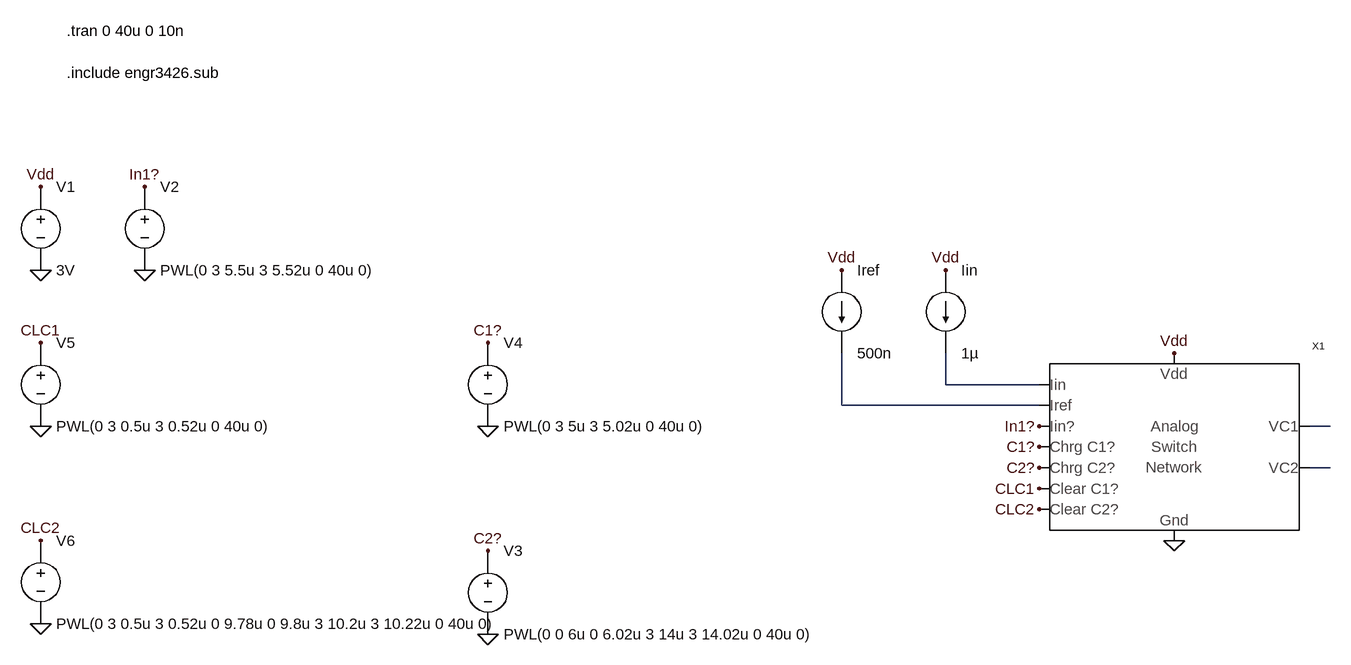
[diagram p0: schematic analog_switch_current_steer_test.asc]
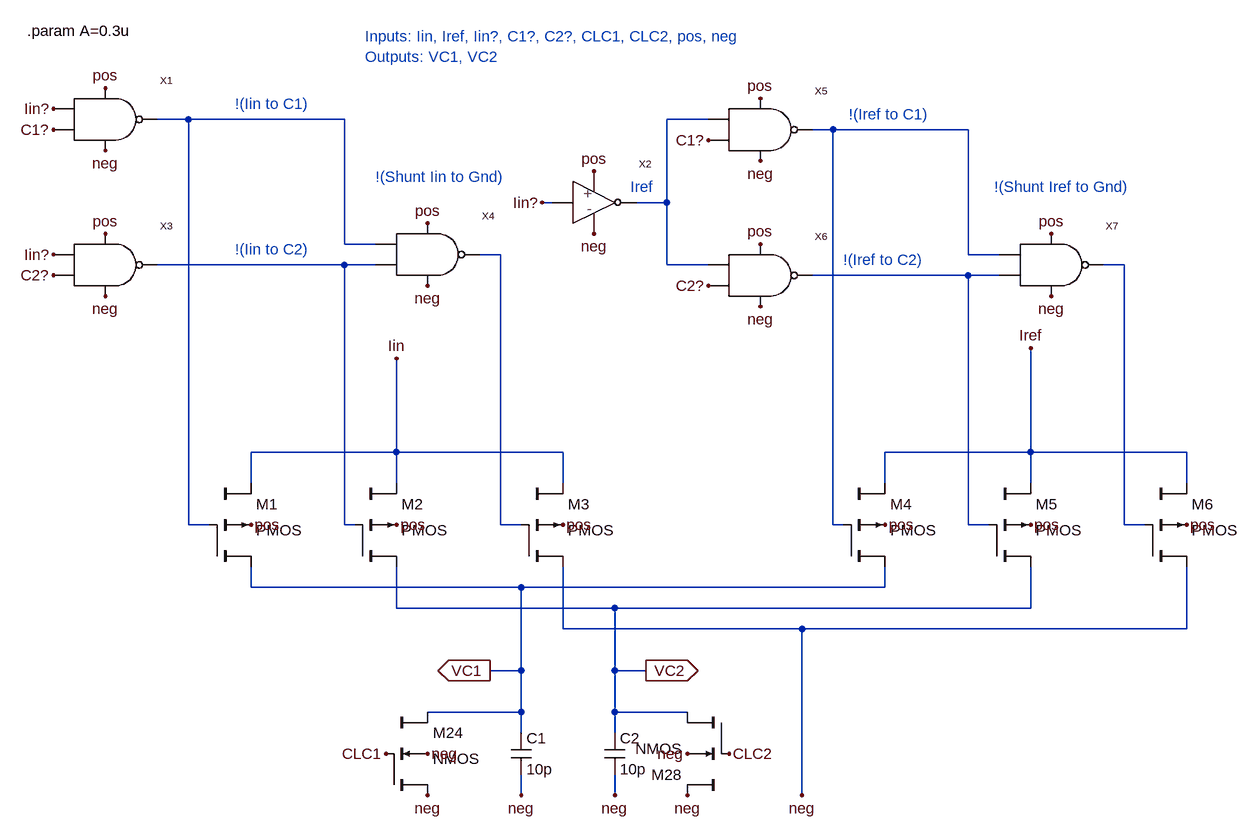
[diagram p1: sub-circuit analog_switch_current_steer.asc]
analog_switch_current_steer_test.asc, the LTspice schematic file:
Version 4
SHEET 1 2404 980
WIRE 960 16 960 -32
WIRE 1104 16 960 16
WIRE 800 48 800 -32
WIRE 1104 48 800 48
WIRE 1552 80 1520 80
WIRE 1552 144 1520 144
FLAG 960 -160 Vdd
FLAG 800 -160 Vdd
FLAG -432 -160 0
FLAG -432 -288 Vdd
FLAG -272 -160 0
FLAG -272 -288 In1?
FLAG 256 400 0
FLAG 256 272 C2?
FLAG 256 80 0
FLAG 256 -48 C1?
FLAG -432 80 0
FLAG -432 -48 CLC1
FLAG -432 384 0
FLAG -432 256 CLC2
FLAG 1104 80 In1?
FLAG 1104 112 C1?
FLAG 1104 144 C2?
FLAG 1104 176 CLC1
FLAG 1104 208 CLC2
FLAG 1312 -32 Vdd
FLAG 1312 256 0
SYMBOL cktsym\\isource 960 -96 R0
WINDOW 123 0 0 Left 2
WINDOW 39 0 0 Left 2
SYMATTR Value 1µ
SYMATTR InstName Iin
SYMBOL cktsym\\isource 800 -96 R0
WINDOW 123 0 0 Left 2
WINDOW 39 0 0 Left 2
SYMATTR Value 500n
SYMATTR InstName Iref
SYMBOL cktsym\\vsource -432 -224 R0
WINDOW 123 0 0 Left 2
WINDOW 39 0 0 Left 2
SYMATTR Value 3V
SYMATTR InstName V1
SYMBOL cktsym\\vsource -272 -224 R0
WINDOW 123 0 0 Left 2
WINDOW 39 0 0 Left 2
SYMATTR Value PWL(0 3 5.5u 3 5.52u 0 40u 0)
SYMATTR InstName V2
SYMBOL cktsym\\vsource 256 336 R0
WINDOW 123 0 0 Left 2
WINDOW 39 0 0 Left 2
SYMATTR Value PWL(0 0 6u 0 6.02u 3 14u 3 14.02u 0 40u 0)
SYMATTR InstName V3
SYMBOL cktsym\\vsource 256 16 R0
WINDOW 123 0 0 Left 2
WINDOW 39 0 0 Left 2
SYMATTR Value PWL(0 3 5u 3 5.02u 0 40u 0)
SYMATTR InstName V4
SYMBOL cktsym\\vsource -432 16 R0
WINDOW 123 0 0 Left 2
WINDOW 39 0 0 Left 2
SYMATTR Value PWL(0 3 0.5u 3 0.52u 0 40u 0)
SYMATTR InstName V5
SYMBOL cktsym\\vsource -432 320 R0
WINDOW 123 0 0 Left 2
WINDOW 39 0 0 Left 2
SYMATTR Value PWL(0 3 0.5u 3 0.52u 0 9.78u 0 9.8u 3 10.2u 3 10.22u 0 40u 0)
SYMATTR InstName V6
SYMBOL analog_switch_current_steer 1312 112 R0
SYMATTR InstName X1
TEXT -392 -464 Left 2 !.include engr3426.sub
TEXT -392 -528 Left 2 !.tran 0 40u 0 10n

analog_switch_current_steer.asc, the sub-circuit schematic file:
Version 4
SHEET 1 2628 980
WIRE 272 -576 224 -576
WIRE 512 -576 272 -576
WIRE 1072 -576 1008 -576
WIRE 1264 -560 1232 -560
WIRE 1472 -560 1264 -560
WIRE 832 -448 816 -448
WIRE 1008 -448 1008 -576
WIRE 1008 -448 960 -448
WIRE 512 -384 512 -576
WIRE 560 -384 512 -384
WIRE 752 -368 720 -368
WIRE 1472 -368 1472 -560
WIRE 1520 -368 1472 -368
WIRE 512 -352 224 -352
WIRE 560 -352 512 -352
WIRE 1008 -352 1008 -448
WIRE 1072 -352 1008 -352
WIRE 1712 -352 1680 -352
WIRE 1472 -336 1232 -336
WIRE 1520 -336 1472 -336
WIRE 592 -64 592 -208
WIRE 592 -64 368 -64
WIRE 848 -64 592 -64
WIRE 1568 -64 1568 -224
WIRE 1568 -64 1344 -64
WIRE 1808 -64 1568 -64
WIRE 368 -16 368 -64
WIRE 592 -16 592 -64
WIRE 848 -16 848 -64
WIRE 1344 -16 1344 -64
WIRE 1568 -16 1568 -64
WIRE 1808 -16 1808 -64
WIRE 272 48 272 -576
WIRE 304 48 272 48
WIRE 512 48 512 -352
WIRE 528 48 512 48
WIRE 752 48 752 -368
WIRE 784 48 752 48
WIRE 1264 48 1264 -560
WIRE 1280 48 1264 48
WIRE 1472 48 1472 -336
WIRE 1504 48 1472 48
WIRE 1712 48 1712 -352
WIRE 1744 48 1712 48
WIRE 368 144 368 112
WIRE 784 144 368 144
WIRE 1344 144 1344 112
WIRE 1344 144 784 144
WIRE 592 176 592 112
WIRE 928 176 592 176
WIRE 1568 176 1568 112
WIRE 1568 176 928 176
WIRE 848 208 848 112
WIRE 1216 208 848 208
WIRE 1808 208 1808 112
WIRE 1808 208 1216 208
WIRE 784 272 784 144
WIRE 784 272 736 272
WIRE 928 272 928 176
WIRE 976 272 928 272
WIRE 784 336 784 272
WIRE 784 336 640 336
WIRE 928 336 928 272
WIRE 1040 336 928 336
WIRE 784 368 784 336
WIRE 928 368 928 336
WIRE 784 464 784 432
WIRE 928 464 928 432
WIRE 1216 464 1216 208
FLAG 368 48 pos
FLAG 592 48 pos
FLAG 1344 48 pos
FLAG 1568 48 pos
FLAG 1808 48 pos
FLAG 816 -448 Iin?
FLAG 576 400 CLC1
FLAG 1104 400 CLC2
FLAG 848 48 pos
FLAG 640 464 neg
FLAG 784 464 neg
FLAG 928 464 neg
FLAG 1040 464 neg
FLAG 640 400 neg
FLAG 1040 400 neg
FLAG 1216 464 neg
FLAG 64 -560 C1?
FLAG 64 -592 Iin?
FLAG 144 -624 pos
FLAG 144 -528 neg
FLAG 896 -400 neg
FLAG 896 -496 pos
FLAG 64 -336 C2?
FLAG 64 -368 Iin?
FLAG 144 -400 pos
FLAG 144 -304 neg
FLAG 640 -416 pos
FLAG 640 -320 neg
FLAG 1072 -544 C1?
FLAG 1152 -608 pos
FLAG 1152 -512 neg
FLAG 1072 -320 C2?
FLAG 1152 -384 pos
FLAG 1152 -288 neg
FLAG 1600 -400 pos
FLAG 1600 -304 neg
FLAG 592 -208 Iin
FLAG 1568 -224 Iref
FLAG 736 272 VC1
IOPIN 736 272 Out
FLAG 976 272 VC2
IOPIN 976 272 Out
SYMBOL cktsym\\pmos4 368 48 R0
SYMATTR InstName M1
SYMATTR Value2 l={2*A} w={6*A}
SYMBOL cktsym\\pmos4 592 48 R0
SYMATTR InstName M2
SYMATTR Value2 l={2*A} w={6*A}
SYMBOL cktsym\\pmos4 1344 48 R0
SYMATTR InstName M4
SYMATTR Value2 l={2*A} w={6*A}
SYMBOL cktsym\\pmos4 1568 48 R0
SYMATTR InstName M5
SYMATTR Value2 l={2*A} w={6*A}
SYMBOL cktsym\\pmos4 1808 48 R0
SYMATTR InstName M6
SYMATTR Value2 l={2*A} w={6*A}
SYMBOL cap 768 368 R0
SYMATTR InstName C1
SYMATTR Value 10p
SYMBOL cap 912 368 R0
SYMATTR InstName C2
SYMATTR Value 10p
SYMBOL cktsym\\nmos4 640 400 R0
SYMATTR InstName M24
SYMATTR Value2 l={2*A} w={24*A}
SYMBOL cktsym\\nmos4 1040 400 R180
SYMATTR InstName M28
SYMATTR Value2 l={2*A} w={24*A}
SYMBOL cktsym\\pmos4 848 48 R0
SYMATTR InstName M3
SYMATTR Value2 l={2*A} w={6*A}
SYMBOL NAND 144 -576 R0
SYMATTR InstName X1
SYMATTR SpiceLine nmosL={2*A} pmosL={2*A} nmosW={3*A} pmosW={6*A}
SYMBOL Inverter 896 -448 R0
SYMATTR InstName X2
SYMATTR SpiceLine nmosL={2*A} pmosL={2*A} nmosW={3*A} pmosW={6*A}
SYMBOL NAND 144 -352 R0
SYMATTR InstName X3
SYMATTR SpiceLine nmosL={2*A} pmosL={2*A} nmosW={3*A} pmosW={6*A}
SYMBOL NAND 640 -368 R0
SYMATTR InstName X4
SYMATTR SpiceLine nmosL={2*A} pmosL={2*A} nmosW={3*A} pmosW={6*A}
SYMBOL NAND 1152 -560 R0
SYMATTR InstName X5
SYMATTR SpiceLine nmosL={2*A} pmosL={2*A} nmosW={3*A} pmosW={6*A}
SYMBOL NAND 1152 -336 R0
SYMATTR InstName X6
SYMATTR SpiceLine nmosL={2*A} pmosL={2*A} nmosW={3*A} pmosW={6*A}
SYMBOL NAND 1600 -352 R0
SYMATTR InstName X7
SYMATTR SpiceLine nmosL={2*A} pmosL={2*A} nmosW={3*A} pmosW={6*A}
TEXT 344 -376 Left 2 ;!(Iin to C2)
TEXT 344 -600 Left 2 ;!(Iin to C1)
TEXT 24 -712 Left 2 !.param A=0.3u
TEXT 560 -488 Left 2 ;!(Shunt Iin to Gnd)
TEXT 952 -472 Left 2 ;Iref
TEXT 1288 -584 Left 2 ;!(Iref to C1)
TEXT 1280 -360 Left 2 ;!(Iref to C2)
TEXT 1512 -472 Left 2 ;!(Shunt Iref to Gnd)
TEXT 544 -704 Left 2 ;Inputs: Iin, Iref, Iin?, C1?, C2?, CLC1, CLC2, pos, neg
TEXT 544 -672 Left 2 ;Outputs: VC1, VC2

The netlist it stands for:
* analog_switch_current_steer_test.asc
Iin Vdd N001 1µ
Iref Vdd N002 500n
V1 Vdd 0 3V
V2 In1? 0 PWL(0 3 5.5u 3 5.52u 0 40u 0)
V3 C2? 0 PWL(0 0 6u 0 6.02u 3 14u 3 14.02u 0 40u 0)
V4 C1? 0 PWL(0 3 5u 3 5.02u 0 40u 0)
V5 CLC1 0 PWL(0 3 0.5u 3 0.52u 0 40u 0)
V6 CLC2 0 PWL(0 3 0.5u 3 0.52u 0 9.78u 0 9.8u 3 10.2u 3 10.22u 0 40u 0)
XX1 N001 N002 In1? C1? C2? CLC1 CLC2 Vdd 0 N003 N004 analog_switch_current_steer

* block symbol definitions
.subckt analog_switch_current_steer Iin Iref Iin? C1? C2? CLC1 CLC2 pos neg VC1 VC2
M1 VC1 N001 Iin pos PMOS l={2*A} w={6*A}
M2 VC2 N005 Iin pos PMOS l={2*A} w={6*A}
M4 VC1 N003 Iref pos PMOS l={2*A} w={6*A}
M5 VC2 N007 Iref pos PMOS l={2*A} w={6*A}
M6 neg N006 Iref pos PMOS l={2*A} w={6*A}
C1 VC1 neg 10p
C2 VC2 neg 10p
M24 VC1 CLC1 neg neg NMOS l={2*A} w={24*A}
M28 neg CLC2 VC2 neg NMOS l={2*A} w={24*A}
M3 neg N004 Iin pos PMOS l={2*A} w={6*A}
XX1 Iin? N001 C1? pos neg NAND nmosL={2*A} pmosL={2*A} nmosW={3*A} pmosW={6*A}  ; pins A OUT B Vdd GROUND
XX2 Iin? N002 pos neg Inverter nmosL={2*A} pmosL={2*A} nmosW={3*A} pmosW={6*A}  ; pins IN OUT pos neg
XX3 Iin? N005 C2? pos neg NAND nmosL={2*A} pmosL={2*A} nmosW={3*A} pmosW={6*A}  ; pins A OUT B Vdd GROUND
XX4 N001 N004 N005 pos neg NAND nmosL={2*A} pmosL={2*A} nmosW={3*A} pmosW={6*A}  ; pins A OUT B Vdd GROUND
XX5 N002 N003 C1? pos neg NAND nmosL={2*A} pmosL={2*A} nmosW={3*A} pmosW={6*A}  ; pins A OUT B Vdd GROUND
XX6 N002 N007 C2? pos neg NAND nmosL={2*A} pmosL={2*A} nmosW={3*A} pmosW={6*A}  ; pins A OUT B Vdd GROUND
XX7 N003 N006 N007 pos neg NAND nmosL={2*A} pmosL={2*A} nmosW={3*A} pmosW={6*A}  ; pins A OUT B Vdd GROUND
* !(Iin to C2)
* !(Iin to C1)
.param A=0.3u
* !(Shunt Iin to Gnd)
* Iref
* !(Iref to C1)
* !(Iref to C2)
* !(Shunt Iref to Gnd)
* Inputs: Iin, Iref, Iin?, C1?, C2?, CLC1, CLC2, pos, neg
* Outputs: VC1, VC2
.ends analog_switch_current_steer

.model NMOS NMOS
.model PMOS PMOS
.lib standard.mos
.include engr3426.sub
.tran 0 40u 0 10n
.backanno
.end